# Altium schematic sheet Fan.SchDoc
size A3; SheetNumber: 5; SheetTotal: 7
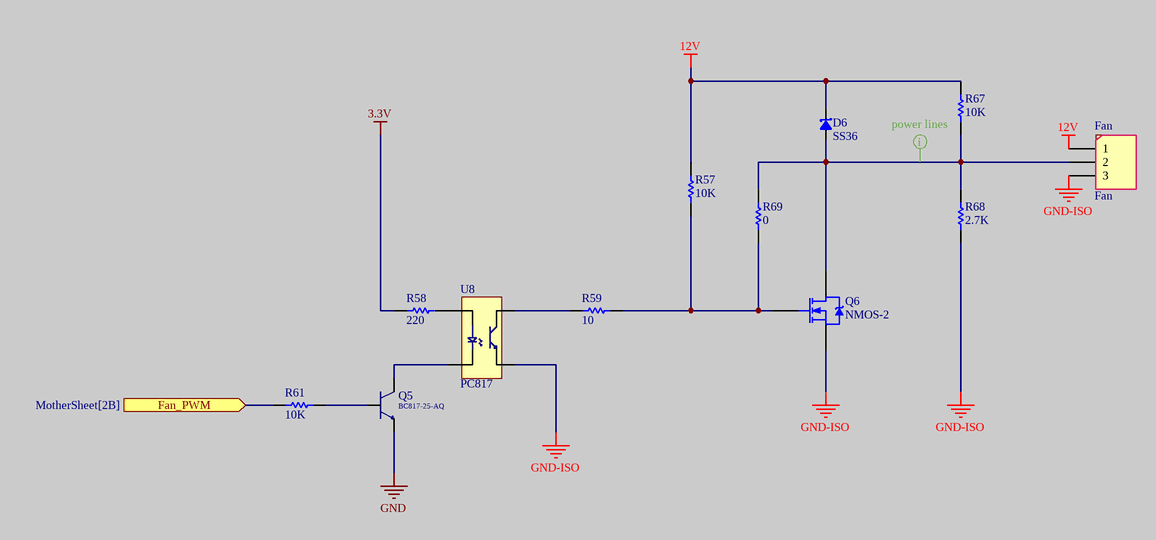
[diagram p0: Fan.SchDoc]

## Parts
D6  SS36  [SMA]
Fan  Fan  [HEADER1*3]
Q5  Transistor: BC817-25-AQ  [NPN]  (hidden comment: NPN transistor)
Q6  NMOS-2  [dpak]
R57  10K  [RESC0603]
R58  220  [RESC0603]
R59  10  [RESC0603]
R61  10K  [RESC0603]
R67  10K  [RESC0603]
R68  2.7K  [RESC0603]
R69  0  [RESC0603]
U8  PC817  [PC817]

## Ports
Fan_PWM (in, see MotherSheet[2B])

## Nets
3.3V: R58.2
12V: D6.2(K) Fan.1 R57.1 R67.1
GND: Q5.2(E)
GND-ISO: Fan.3 Q6.3(S) R68.2 U8.3
Fan_PWM: R61.2 ; port Fan_PWM
NetD6_1: D6.1(A) Fan.2 Q6.2(D) R67.2 R68.1 R69.1
NetQ5_1: Q5.1(B) R61.1
NetQ5_3: Q5.3(C) U8.2
NetQ6_1: Q6.1(G) R57.2 R59.2 R69.2
NetR58_1: R58.1 U8.1
NetR59_1: R59.1 U8.4

## Layout directives
rule Width Constraint [Pref Width = 1mm    Min Width = 1mm    Max Width = 1mm]; rule Routing Via Style [Pref Size = 2mm    Pref Hole Size = 1mm]; rule Routing Via Style [Pref Size = 2mm    Pref Hole Size = 1mm]: NetD6_1

## Library data of the parts
D6 = SS36: Fast Schottky Diode; Published: 8-Jun-2000; LatestRevisionDate: 17-Jul-2002; LatestRevisionNote: Re-released for DXP Platform.; PackageReference: SMB; Publisher: Altium Limited; Code_JEDEC: DO-214-AA
Fan = Header1*3: Header, 3-Pin; LatestRevisionDate: 17-Jul-2002; LatestRevisionNote: Re-released for DXP Platform.; Publisher: Altium Limited
Q5 = BC817: 45 V, 0.5 A
Q6 = NMOS-2: N-Channel Power MOSFET; Note: Pin 2 is electrically connected to pin 4.; Published: 8-Jun-2000; LatestRevisionDate: 17-Jul-2002; LatestRevisionNote: Re-released for DXP Platform.; DatasheetVersion: PD-9.814; PackageVersion: Feb-1997; PackageReference: TO-220AB; Publisher: Altium Limited; PackageDescription: TO, Thru-Hole, Vertical, Heatsink Mounted; 3 In-Line Leads; Pitch 2.54 mm; ComponentLink1Description: Manufacturer Link; ComponentLink1URL: http://www.irf.com/
R57-R59 R61 R67-R69 = Resistor: 0603,0.1W; Published: 8-Jun-2000; LatestRevisionDate: 17-Jul-2002; LatestRevisionNote: Re-released for DXP Platform.; PackageReference: AXIAL-0.5; Publisher: Altium Limited
  R57 R61 R67: Value: 10K
  R58: Value: 220
  R59: Value: 10
  R68: Value: 2.7K
  R69: Value: 0
U8 = PC817: PC817 optocoupler